# EAGLE design PIN_1_0 (EAGLE 7.6.0)
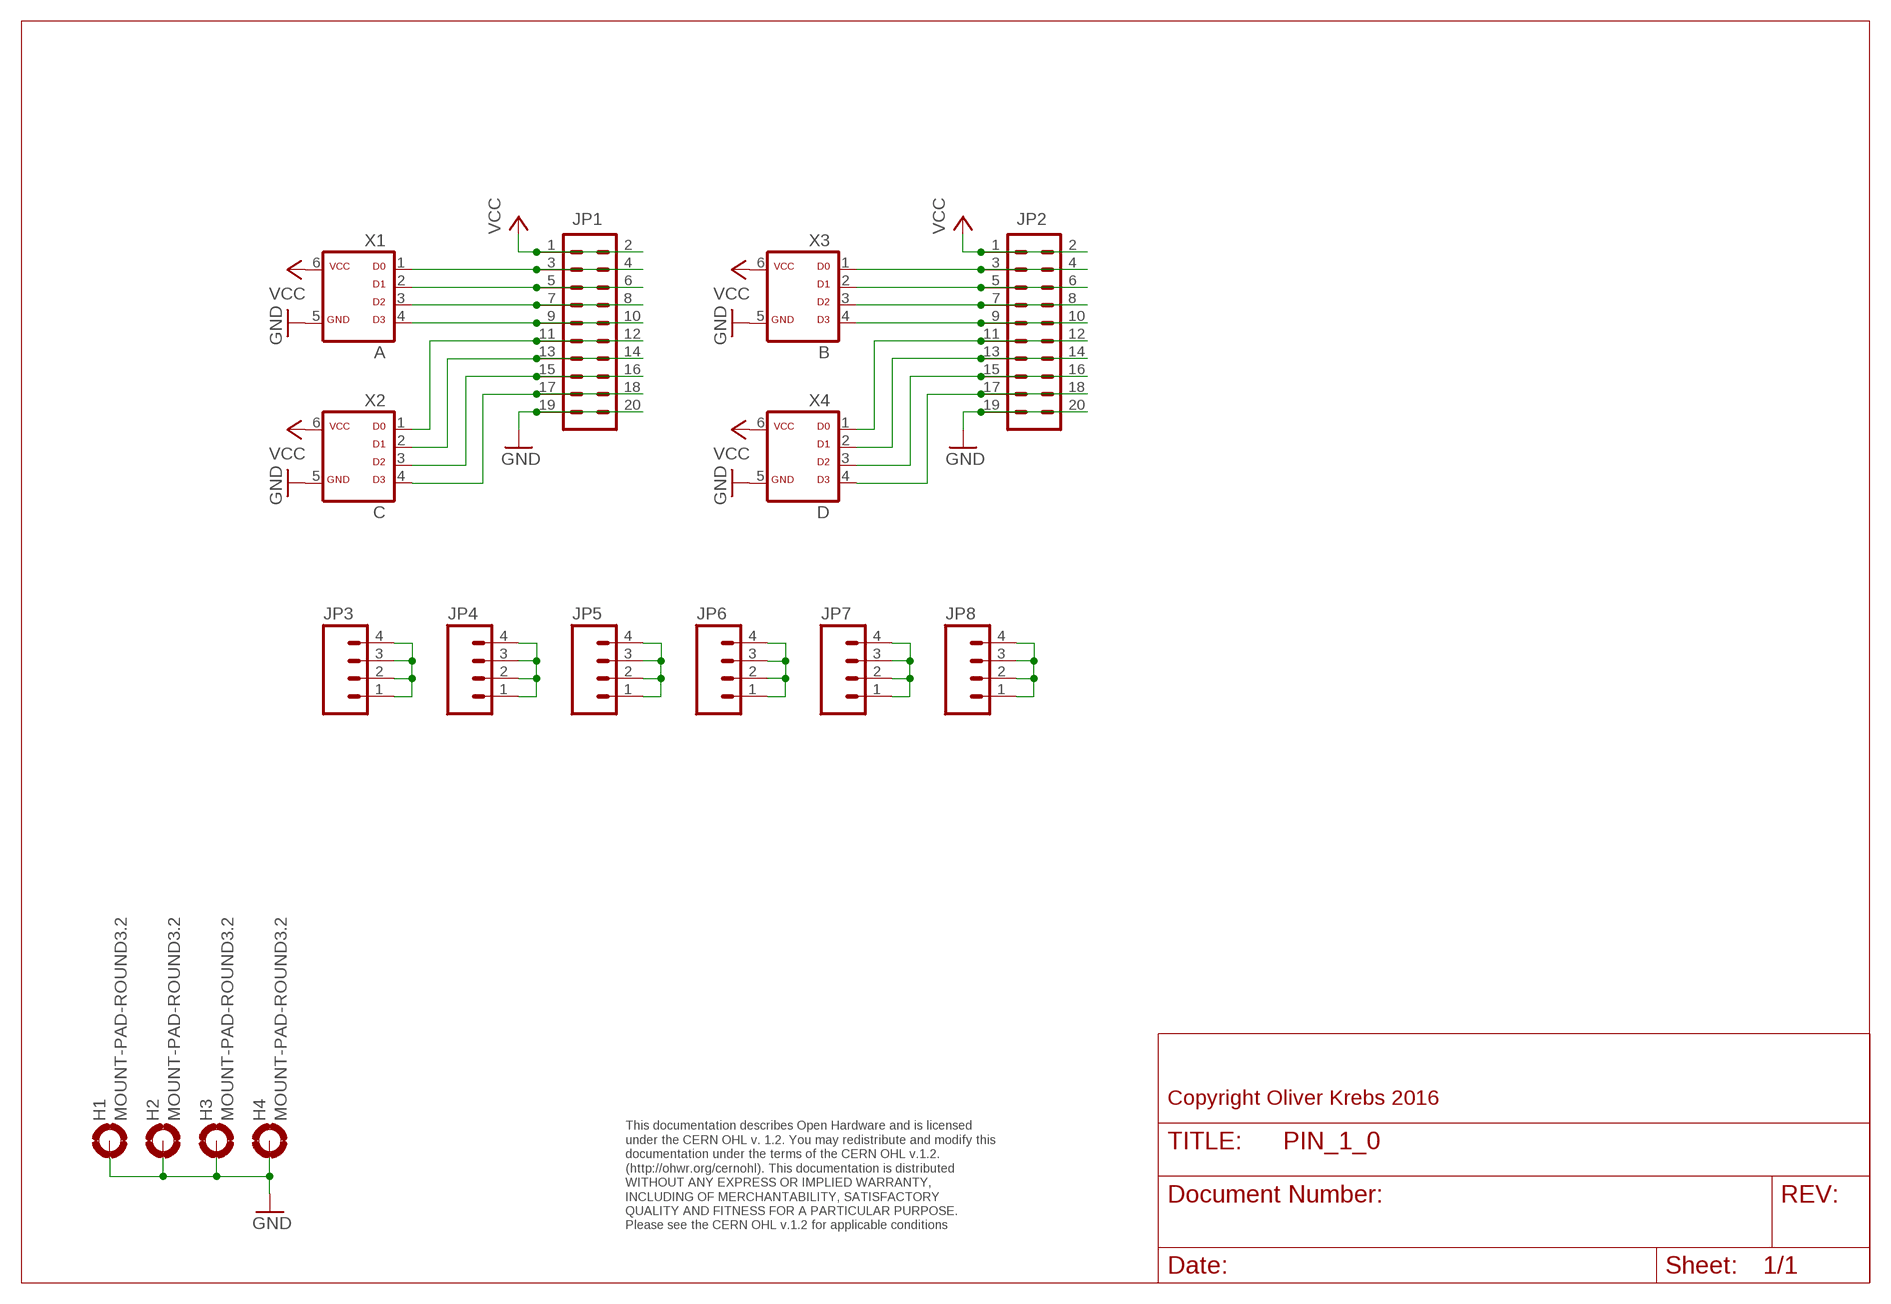
[diagram p0: schematic, sheet 1]

## Parts
H1  MOUNT-PAD-ROUND3.2  [3,2-PAD]
H2  MOUNT-PAD-ROUND3.2  [3,2-PAD]
H3  MOUNT-PAD-ROUND3.2  [3,2-PAD]
H4  MOUNT-PAD-ROUND3.2  [3,2-PAD]
JP1  M10X2  [2X10]
JP2  M10X2  [2X10]
JP3  M04PTH  [1X04]
JP4  M04PTH  [1X04]
JP5  M04PTH  [1X04]
JP6  M04PTH  [1X04]
JP7  M04PTH  [1X04]
JP8  M04PTH  [1X04]
X1  A  ML6D  [ML-6]
X2  C  ML6D  [ML-6]
X3  B  ML6D  [ML-6]
X4  D  ML6D  [ML-6]

## Nets
GND: H1.B3,2(MOUNT) H2.B3,2(MOUNT) H3.B3,2(MOUNT) H4.B3,2(MOUNT) JP1.19 JP1.20 JP2.19 JP2.20 X1.5 X2.5 X3.5 X4.5
N$1: JP2.3 JP2.4 X3.1
N$2: JP2.5 JP2.6 X3.2
N$3: JP2.7 JP2.8 X3.3
N$4: JP2.9 JP2.10 X3.4
N$5: JP2.11 JP2.12 X4.1
N$6: JP2.13 JP2.14 X4.2
N$7: JP2.15 JP2.16 X4.3
N$8: JP2.17 JP2.18 X4.4
N$9: JP1.3 JP1.4 X1.1
N$10: JP1.5 JP1.6 X1.2
N$11: JP1.7 JP1.8 X1.3
N$12: JP1.9 JP1.10 X1.4
N$13: JP1.11 JP1.12 X2.1
N$14: JP1.13 JP1.14 X2.2
N$15: JP1.15 JP1.16 X2.3
N$16: JP1.17 JP1.18 X2.4
N$20: JP3.1 JP3.2 JP3.3 JP3.4
N$21: JP4.1 JP4.2 JP4.3 JP4.4
N$22: JP5.1 JP5.2 JP5.3 JP5.4
N$23: JP6.1 JP6.2 JP6.3 JP6.4
N$24: JP7.1 JP7.2 JP7.3 JP7.4
N$25: JP8.1 JP8.2 JP8.3 JP8.4
VCC: JP1.1 JP1.2 JP2.1 JP2.2 X1.6 X2.6 X3.6 X4.6

## Notes on the sheet
- Copyright Oliver Krebs 2016
- This documentation describes Open Hardware and is licensed 
  under the CERN OHL v. 1.2. You may redistribute and modify this 
  documentation under the terms of the CERN OHL v.1.2. 
  (http://ohwr.org/cernohl). This documentation is distributed
  WITHOUT ANY EXPRESS OR IMPLIED WARRANTY, 
  INCLUDING OF MERCHANTABILITY, SATISFACTORY 
  QUALITY AND FITNESS FOR A PARTICULAR PURPOSE. 
  Please see the CERN OHL v.1.2 for applicable conditions

## Library data of the parts
H1-H4 = holes:MOUNT-PAD-ROUND: MOUNTING PAD, round
JP1 JP2 = SparkFun-Connectors:M10X2: This was SPECIALLY designed to be used with our Graphic LCD Backpack. Be sure you want to use this! It is not only staggered on each line of header holes, but IT IS ALSO offset of the center point of the top and bottom lines by 5 mil. This causes the headers to lock into place on the "standard" footprint on the LCD screen. The extra squares on the tdocu layer are there simply to reference other pins (if you were to actually populate a longer header than ten long - this is what we do with the backpacks).
JP3-JP8 = SparkFun-Connectors:M04: Header 4 Standard 4-pin 0.1" header. Use with straight break away headers (SKU : PRT-00116), right angle break away headers (PRT-00553), swiss pins (PRT-00743), machine pins (PRT-00117), and female headers (PRT-00115). Molex polarized connector foot print use with SKU : PRT-08231 with associated crimp pins and housings. 1MM SMD Version SKU: PRT-10208
X1-X4 = 01-my-con:ML6D

## Board
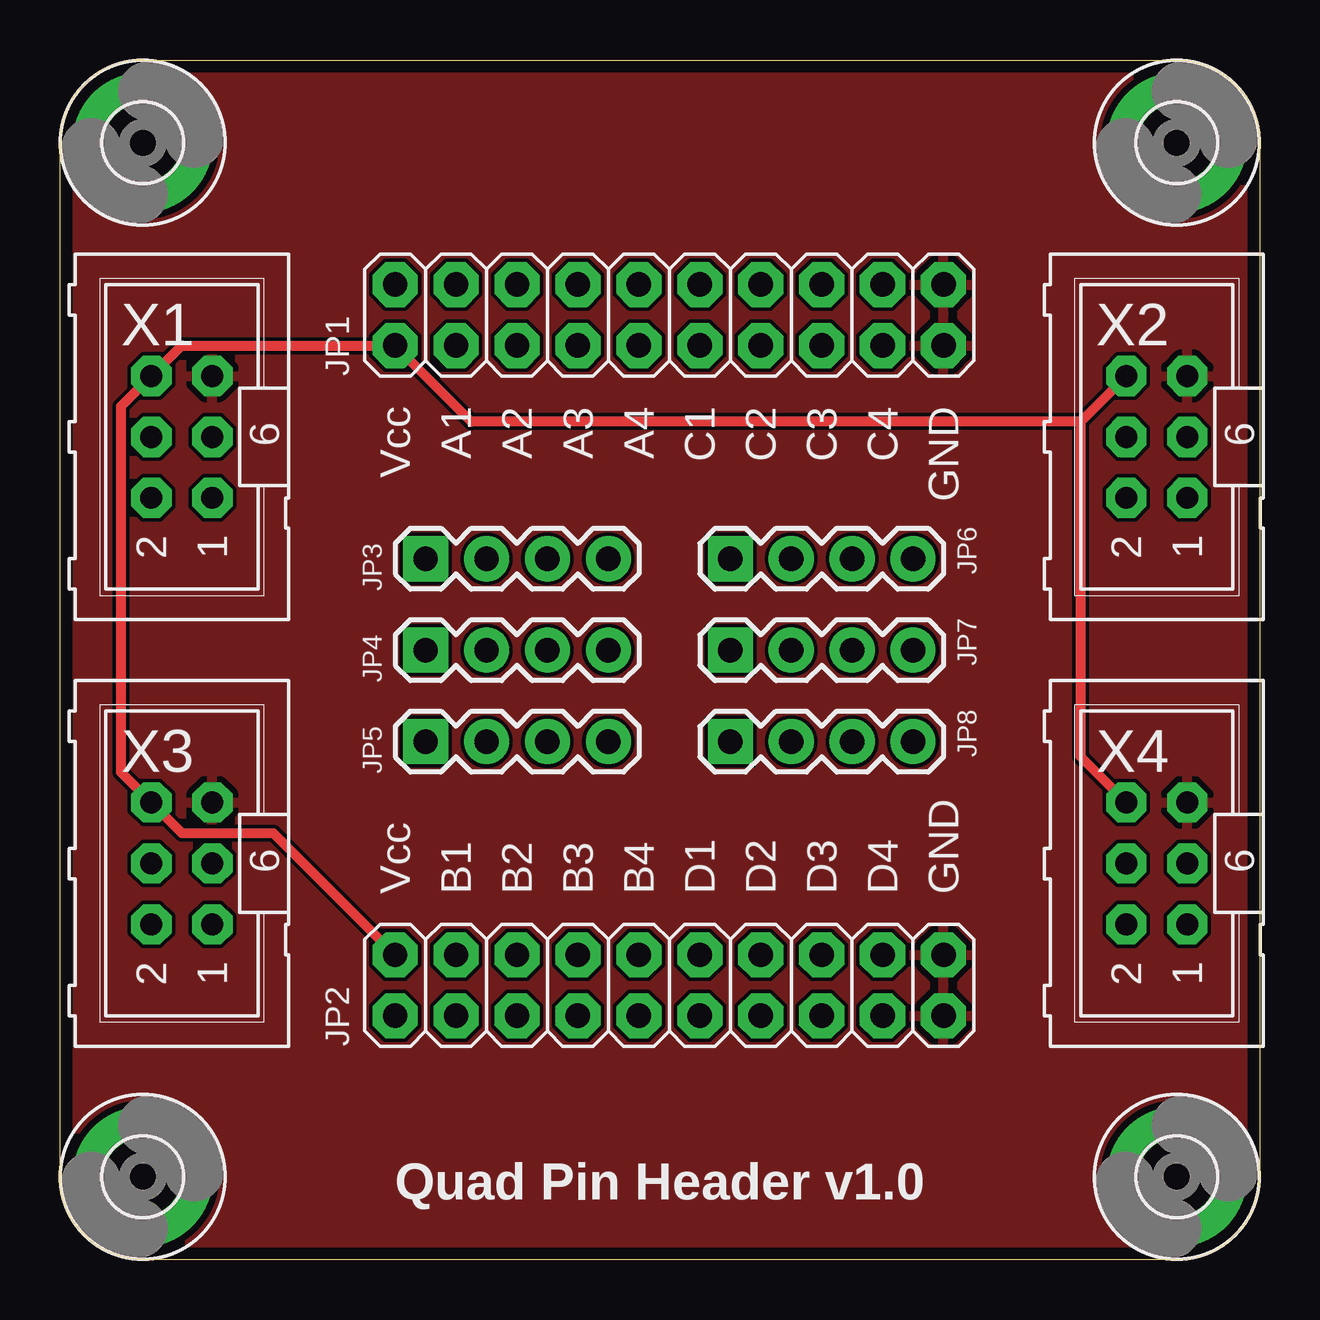
[diagram p1: board, top side]
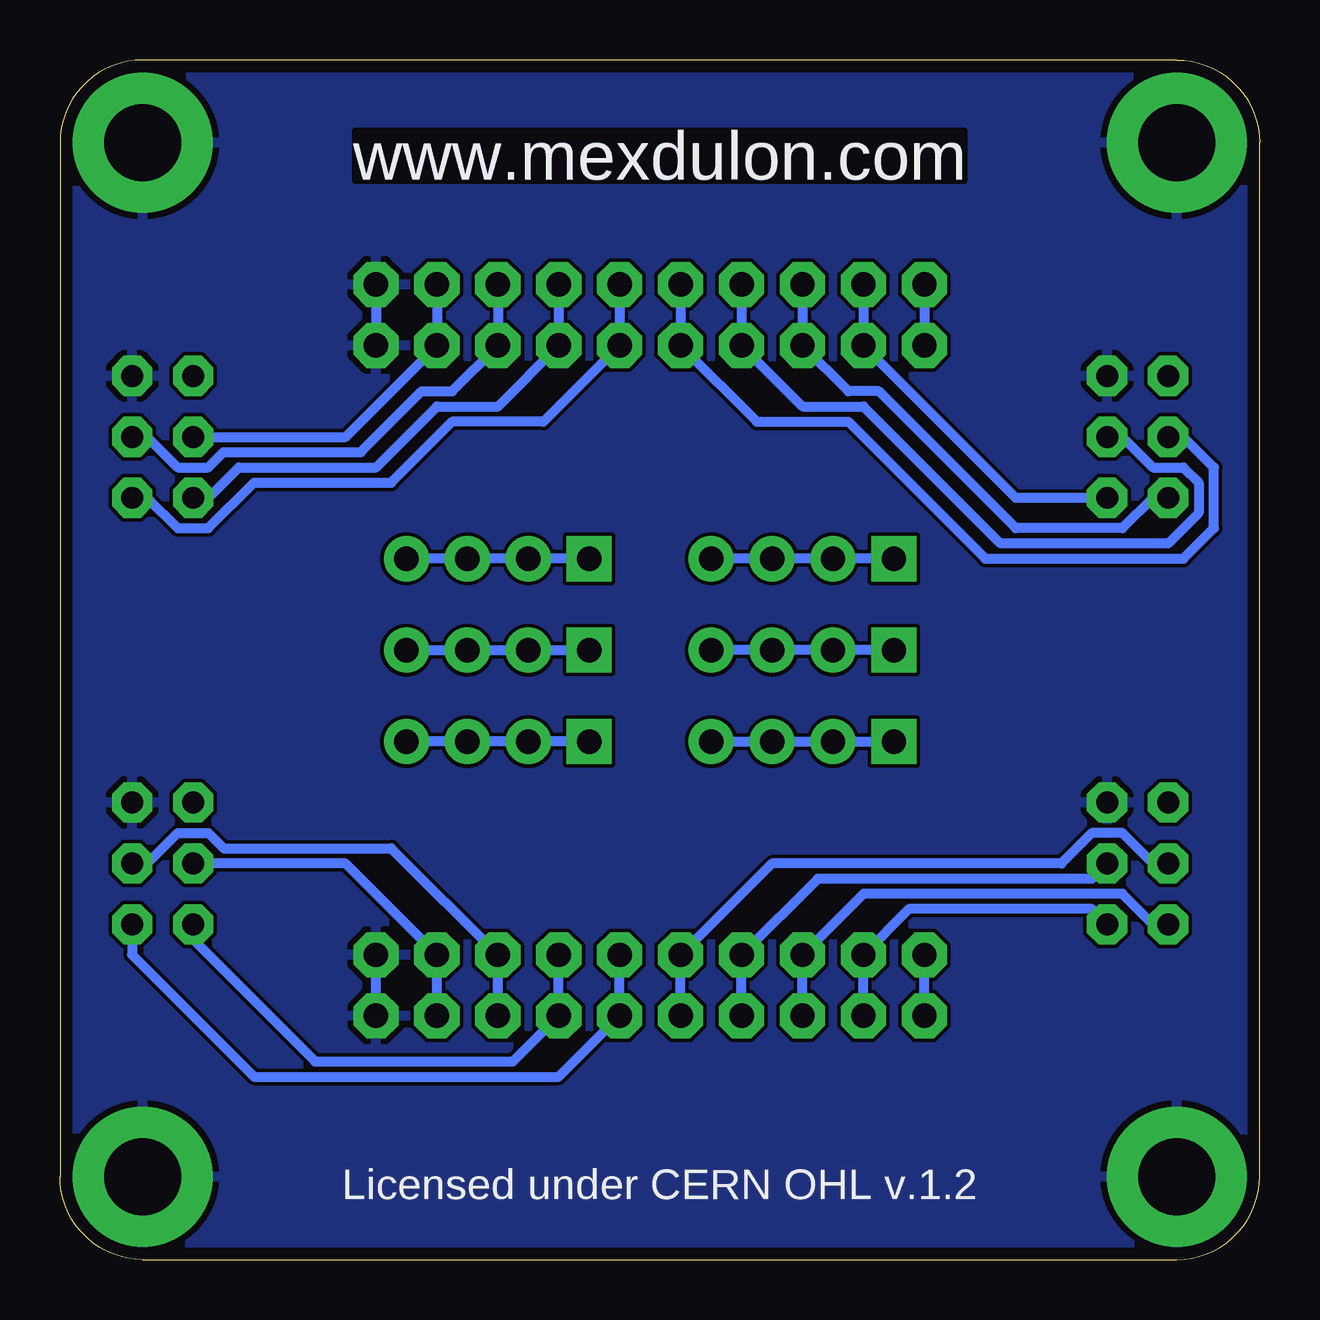
[diagram p2: board, bottom side, seen from below]

Size 50 x 50 mm. Coordinates in mm from the lower left corner, seen from the top.
Outline: 0,3.45 0,46.55 arc-90 3.45,50 46.55,50 arc-90 50,46.55 50,3.45 arc-90 46.55,0 3.45,0 arc-90 0,3.45
Copper layers (1*16): Top 0.035mm / dielectric 1.6mm / Bottom 0.035mm
Design rules "Elecrow_2-layer_PCB_eagle_rule": minimum track width 6mil, minimum drill 12mil, track to track 6mil, track to pad 6mil, pad to pad 6mil, via to via 8mil, smd to smd 0mil, copper to edge 20mil, drill to drill 10mil, minimum pad ring 6mil, minimum via ring 6mil, stop-mask expansion 0mil, vias tented up to drill 100mil, thermal gap 10mil

### Footprints (pad centres in the part's own frame; a part is rotated, then mirrored left to right if it is on the bottom)
3,2-PAD = drill 3.2 pad 5.842: B3,2 0,0
2X10 = drill 1.016 pad 1.88 octagon: 1 -11.43,-1.27; 2 -11.43,1.27; 3 -8.89,-1.27; 4 -8.89,1.27; 5 -6.35,-1.27; 6 -6.35,1.27; 7 -3.81,-1.27; 8 -3.81,1.27; 9 -1.27,-1.27; 10 -1.27,1.27; 11 1.27,-1.27; 12 1.27,1.27; 13 3.81,-1.27; 14 3.81,1.27; 15 6.35,-1.27; 16 6.35,1.27; 17 8.89,-1.27; 18 8.89,1.27; 19 11.43,-1.27; 20 11.43,1.27
1X04 = drill 1.016 pad 1.88 square: 1 0,0 | drill 1.016 pad 1.88: 2 2.54,0; 3 5.08,0; 4 7.62,0
ML-6 = drill 0.914 pad 1.676 octagon: 1 -2.54,-1.27; 2 -2.54,1.27; 3 0,-1.27; 4 0,1.27; 5 2.54,-1.27; 6 2.54,1.27

### Placement (x,y rotation side)
H1  3.45,3.45 0 top
H2  3.45,46.55 0 top
H3  46.55,3.45 0 top
H4  46.55,46.55 0 top
JP1  25.4,39.37 0 top
JP2  25.4,11.43 0 top
JP3  15.24,29.21 0 top
JP4  15.24,25.4 0 top
JP5  15.24,21.59 0 top
JP6  27.94,29.21 0 top
JP7  27.94,25.4 0 top
JP8  27.94,21.59 0 top
X1  5.08,34.29 90 top
X2  45.72,34.29 90 top
X3  5.08,16.51 90 top
X4  45.72,16.51 90 top

### Tracks (layer width: path | path; a pad name or v marks a point on that pad's centre or on a via)
GND
  Bottom 0.406: JP1.20 JP1.19 | JP2.19 JP2.20
  pour Bottom: 0,0 50.8,0 50.8,50.8 0,50.8
  pour Top: 0,50.16 50.16,50.16 50.16,0 0,0
N$1
  Bottom 0.406: JP2.3 JP2.4 14.61,14.61 6.99,14.61 X3.1
N$2
  Bottom 0.406: JP2.5 JP2.6 16.51,15.24 5.71,15.24 4.45,13.97 X3.2
N$3
  Bottom 0.406: JP2.7 JP2.8 18.41,15.88 6.99,15.88 X3.3
N$4
  Bottom 0.406: JP2.9 JP2.10 20.32,16.51 8.26,16.51 6.99,17.78 5.71,17.78 4.45,16.51 X3.4
N$5
  Bottom 0.406: JP2.12 JP2.11 29.21,7.62 41.91,7.62 46.99,12.7 X4.1
N$6
  Bottom 0.406: JP2.14 JP2.13 31.11,8.26 39.37,8.26 44.45,13.34 X4.2
N$7
  Bottom 0.406: JP2.15 JP2.16 36.2,17.14 43.18,17.14 43.81,17.78 45.09,17.78 46.35,16.51 X4.3
N$8
  Bottom 0.406: JP2.17 JP2.18 38.1,16.51 X4.4
N$9
  Bottom 0.406: JP1.4 JP1.3 10.16,31.75 X1.1
N$10
  Bottom 0.406: JP1.6 JP1.5 17.14,36.2 15.88,36.2 10.16,30.48 5.71,30.48 4.45,31.75 X1.2
N$11
  Bottom 0.406: JP1.8 JP1.7 19.05,35.56 16.51,35.56 10.79,29.84 3.81,29.84 2.54,31.11 2.54,32.38 3.17,33.02 4.45,33.02 5.71,34.29 X1.3
N$12
  Bottom 0.406: JP1.10 JP1.9 20.95,34.92 17.14,34.92 11.43,29.21 3.17,29.21 1.91,30.48 1.91,33.02 3.17,34.29 X1.4
N$13
  Bottom 0.406: JP1.12 JP1.11 29.84,34.92 33.66,34.92 36.2,32.38 41.91,32.38 43.81,30.48 45.09,30.48 46.35,31.75 X2.1
N$14
  Bottom 0.406: JP1.14 JP1.13 31.75,35.56 34.29,35.56 36.83,33.02 42.55,33.02 43.81,31.75 X2.2
N$15
  Bottom 0.406: JP1.16 JP1.15 33.66,36.2 34.92,36.2 37.47,33.66 43.18,33.66 43.81,33.02 45.09,33.02 46.35,34.29 X2.3
N$16
  Bottom 0.406: JP1.18 JP1.17 38.1,34.29 X2.4
N$20
  Bottom 0.406: JP3.1 JP3.2 JP3.3 JP3.4
N$21
  Bottom 0.406: JP4.1 JP4.2 JP4.3 JP4.4
N$22
  Bottom 0.406: JP5.4 JP5.3 JP5.2 JP5.1
N$23
  Bottom 0.406: JP6.1 JP6.2 JP6.3 JP6.4
N$24
  Bottom 0.406: JP7.4 JP7.3 JP7.2 JP7.1
N$25
  Bottom 0.406: JP8.1 JP8.2 JP8.3 JP8.4
VCC
  Top 0.406: X2.6 42.55,34.92 | 42.55,34.92 17.14,34.92 JP1.1 5.08,38.1 X1.6 2.54,35.56 2.54,20.32 X3.6 5.08,17.78 8.89,17.78 JP2.2 | X4.6 42.55,20.95 42.55,34.92
  Bottom 0.406: JP1.2 JP1.1 | JP2.1 JP2.2

### Text on the board
Bottom: www.mexdulon.com
tNames: Vcc | A1 | A2 | A3 | A4 | C1 | C2 | C3 | C4 | GND | Vcc | B1 | B2 | B3 | B4 | D1 | D2 | D3 | D4 | GND | Quad Pin Header v1.0
bNames: www.mexdulon.com | Licensed under CERN OHL v.1.2